# EAGLE schematic hand_rev_1.0 (EAGLE 9.2.2)
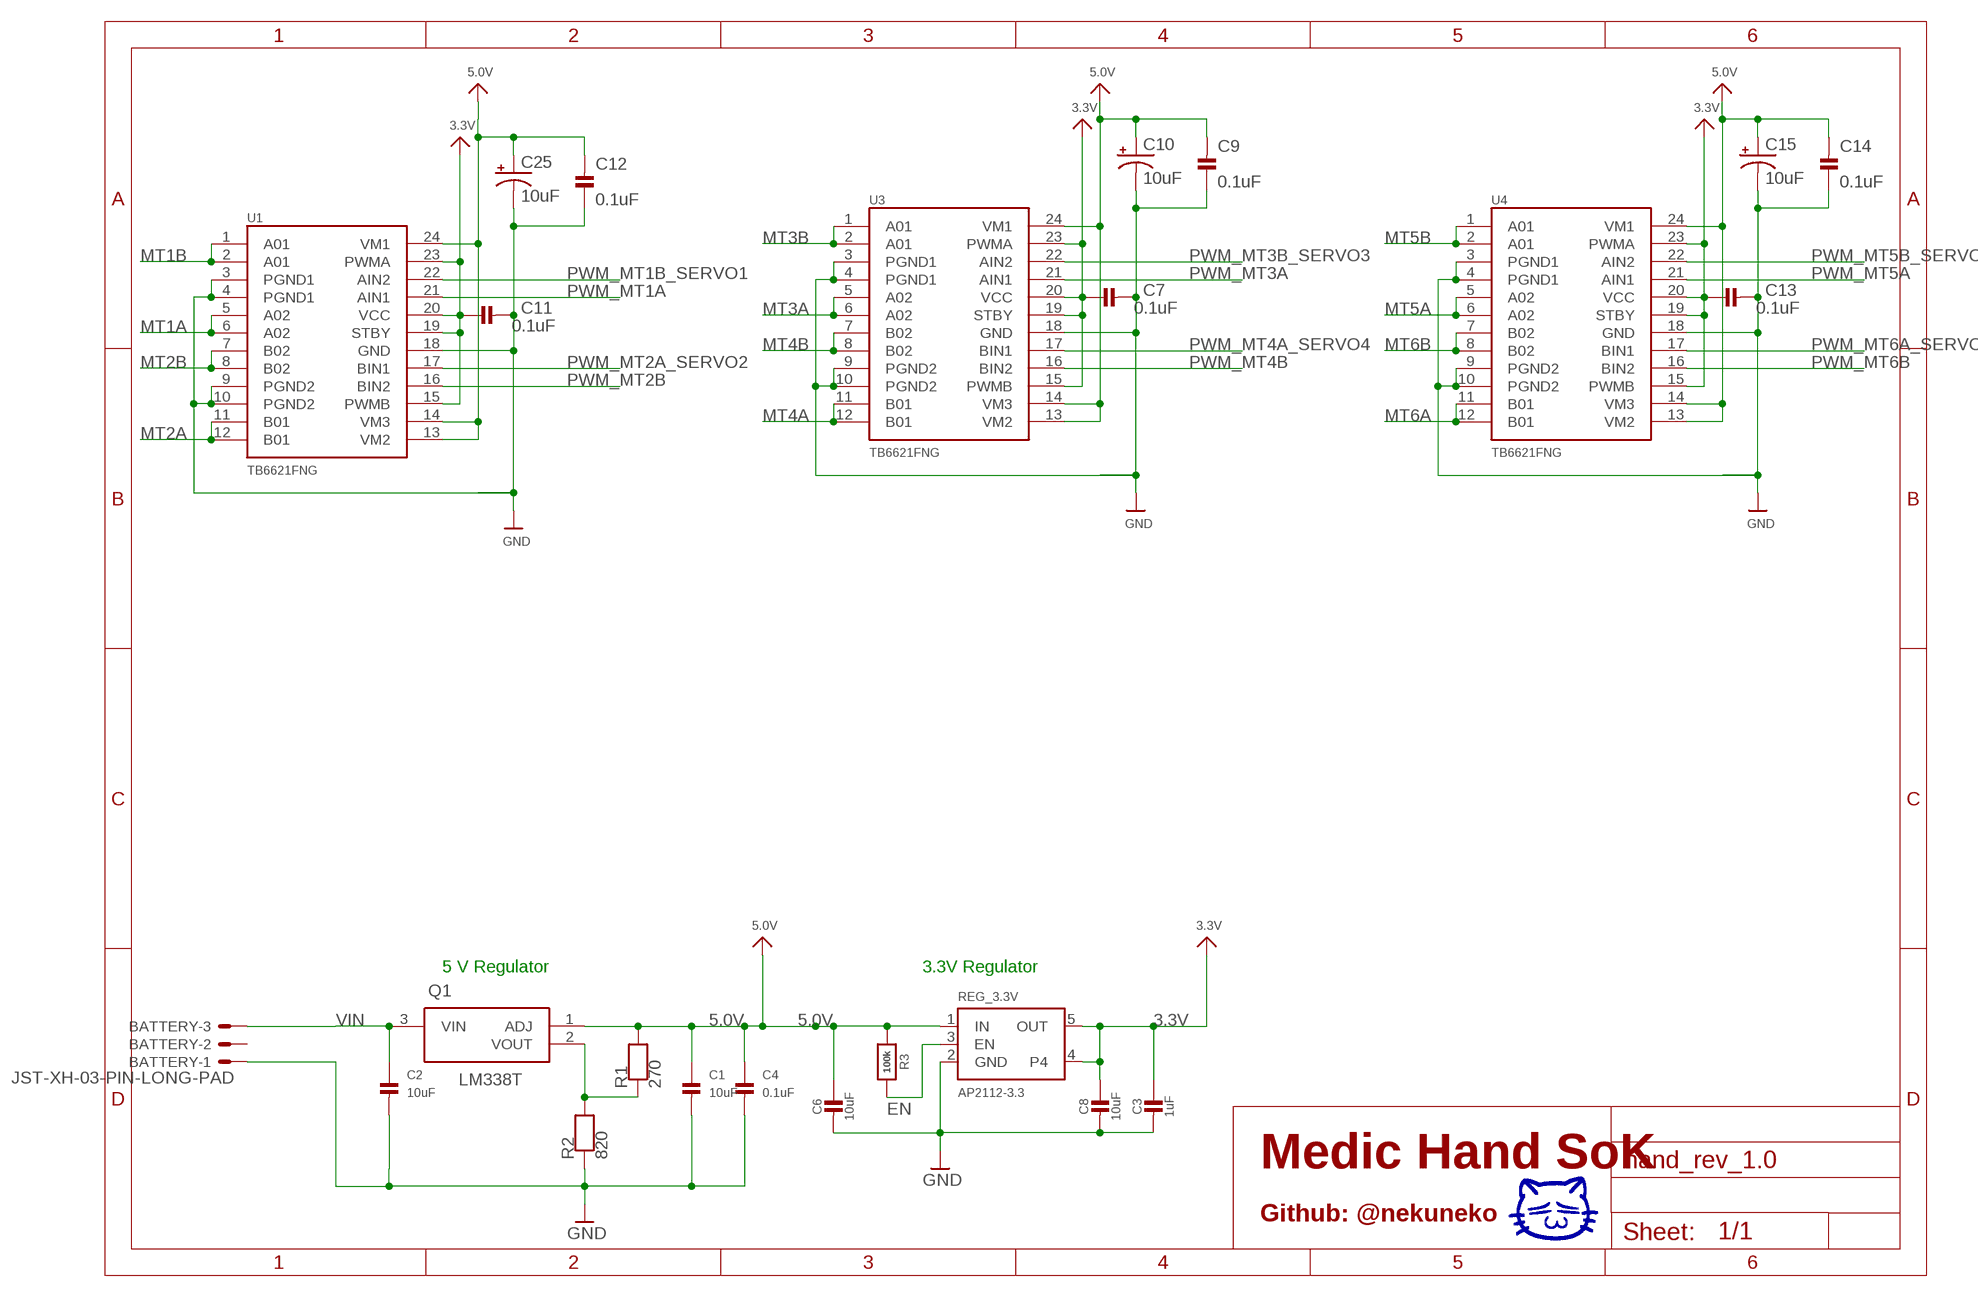
[diagram p0: schematic, sheet 1, part 1 of 2]
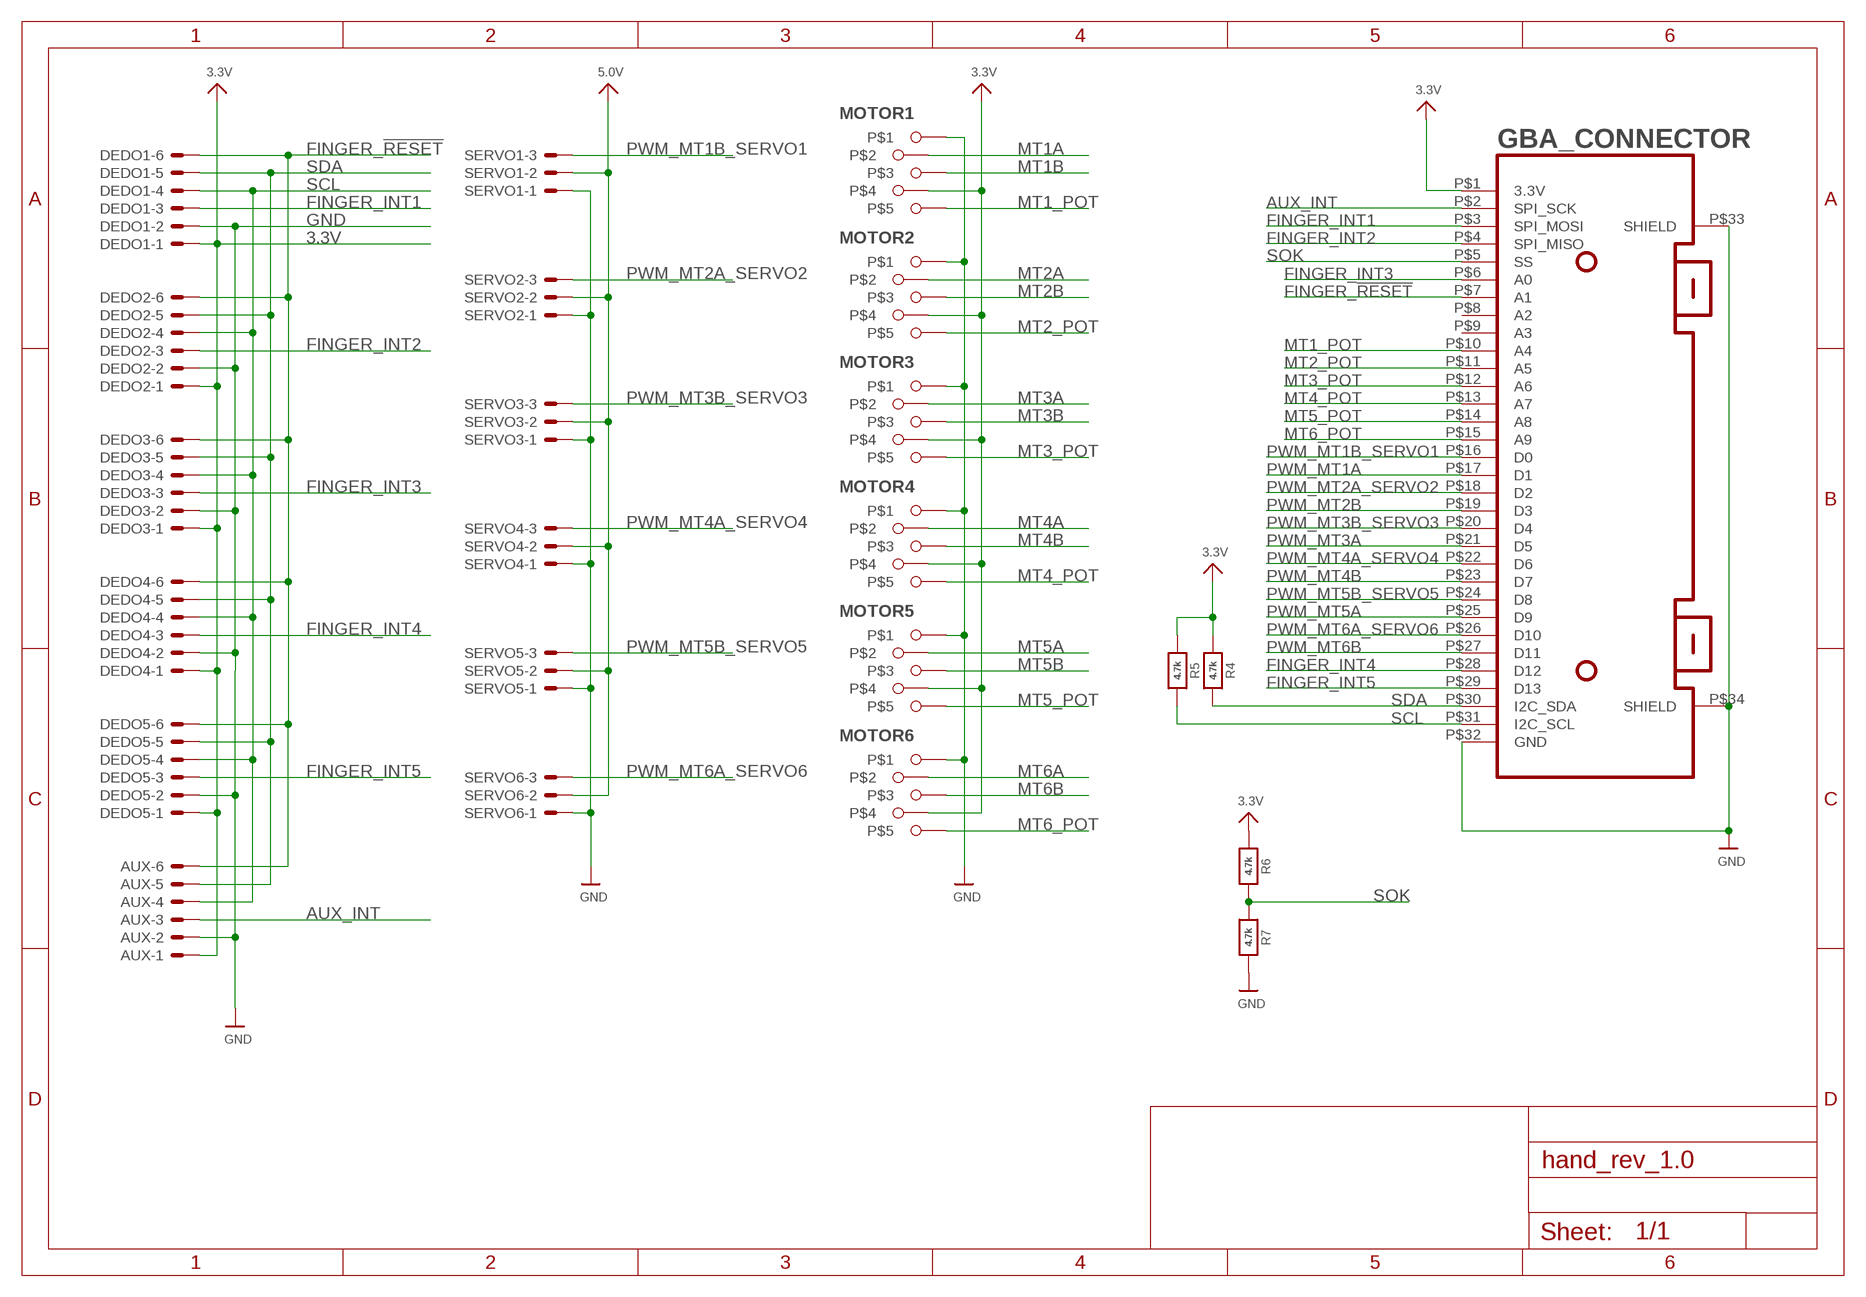
[diagram p1: schematic, sheet 1, part 2 of 2]

## Parts
AUX  FINGER_5  BM06B-SRSS-TB  [BM06B-SRSS-TB]
BATTERY  JST-XH-03-PIN-LONG-PAD  [JST-XH-03-PACKAGE-LONG-PAD]
C1  10uF  CAP_CERAMIC_0805  [_0805]
C2  10uF  CAP_CERAMIC_0805  [_0805]
C3  1uF  CAP_CERAMIC_0603  [_0603]
C4  0.1uF  CAP_CERAMIC_0805  [_0805]
C6  10uF  CAP_CERAMIC_0603  [_0603]
C7  0.1uF  CAP_CERAMIC_0603  [_0603]
C8  10uF  CAP_CERAMIC_0603  [_0603]
C9  0.1uF  CAP_CERAMIC_0603  [_0603]
C10  10uF  10UF-POLAR-0603-6.3V-20%(TANT)  [0603-POLAR]
C11  0.1uF  CAP_CERAMIC_0603  [_0603]
C12  0.1uF  CAP_CERAMIC_0603  [_0603]
C13  0.1uF  CAP_CERAMIC_0603  [_0603]
C14  0.1uF  CAP_CERAMIC_0603  [_0603]
C15  10uF  10UF-POLAR-0603-6.3V-20%(TANT)  [0603-POLAR]
C25  10uF  10UF-POLAR-0603-6.3V-20%(TANT)  [0603-POLAR]
DEDO1  FINGER_1  BM06B-SRSS-TB  [BM06B-SRSS-TB]
DEDO2  FINGER_2  BM06B-SRSS-TB  [BM06B-SRSS-TB]
DEDO3  FINGER_3  BM06B-SRSS-TB  [BM06B-SRSS-TB]
DEDO4  FINGER_4  BM06B-SRSS-TB  [BM06B-SRSS-TB]
DEDO5  FINGER_5  BM06B-SRSS-TB  [BM06B-SRSS-TB]
GBA_CONNECTOR  GBA_CARTRIDGE  [GBA_CARTRIDGE]
MOTOR1  MOTOR1  5PIN  [5PIN]
MOTOR2  MOTOR2  5PIN  [5PIN]
MOTOR3  MOTOR3  5PIN  [5PIN]
MOTOR4  MOTOR4  5PIN  [5PIN]
MOTOR5  MOTOR5  5PIN  [5PIN]
MOTOR6  MOTOR6  5PIN  [5PIN]
Q1  LM338T  [TO220]
R1  270  RESISTOR_0805  [_0805]
R2  820  RESISTOR_0805  [_0805]
R3  100k  RESISTOR_0603  [_0603]
R4  4.7k  RESISTOR_0603  [_0603]
R5  4.7k  RESISTOR_0603  [_0603]
R6  4.7k  RESISTOR_0603  [_0603]
R7  4.7k  RESISTOR_0603  [_0603]
REG_3.3V  AP2112-3.3  VREG_SOT23-5  [SOT23-5]
SERVO1  JST-XH-03-PIN-LONG-PAD  [JST-XH-03-PACKAGE-LONG-PAD]
SERVO2  JST-XH-03-PIN-LONG-PAD  [JST-XH-03-PACKAGE-LONG-PAD]
SERVO3  JST-XH-03-PIN-LONG-PAD  [JST-XH-03-PACKAGE-LONG-PAD]
SERVO4  JST-XH-03-PIN-LONG-PAD  [JST-XH-03-PACKAGE-LONG-PAD]
SERVO5  JST-XH-03-PIN-LONG-PAD  [JST-XH-03-PACKAGE-LONG-PAD]
SERVO6  JST-XH-03-PIN-LONG-PAD  [JST-XH-03-PACKAGE-LONG-PAD]
U1  TB6621FNG  [SSOP24]
U3  TB6621FNG  [SSOP24]
U4  TB6621FNG  [SSOP24]

## Nets
3.3V: AUX.1 C3.1 C7.1 C8.1 C11.1 C13.1 DEDO1.1 DEDO2.1 DEDO3.1 DEDO4.1 DEDO5.1 GBA_CONNECTOR.P$1(3.3V) MOTOR1.4 MOTOR2.4 MOTOR3.4 MOTOR4.4 MOTOR5.4 MOTOR6.4 R4.1 R5.1 R6.1 REG_3.3V.4 REG_3.3V.5(OUT) U1.15(PWMB) U1.19(STBY) U1.20(VCC) U1.23(PWMA) U3.15(PWMB) U3.19(STBY) U3.20(VCC) U3.23(PWMA) U4.15(PWMB) U4.19(STBY) U4.20(VCC) U4.23(PWMA)
5.0V: C1.1 C4.1 C6.1 C9.2 C10.+ C12.2 C14.2 C15.+ C25.+ Q1.1(ADJ) R1.2 R3.1 REG_3.3V.1(IN) SERVO1.2 SERVO2.2 SERVO3.2 SERVO4.2 SERVO5.2 SERVO6.2 U1.13(VM2) U1.14(VM3) U1.24(VM1) U3.13(VM2) U3.14(VM3) U3.24(VM1) U4.13(VM2) U4.14(VM3) U4.24(VM1)
AUX_INT: AUX.3 GBA_CONNECTOR.P$2(SPI_SCK)
EN: R3.2 REG_3.3V.3(EN)
FINGER_!RESET: AUX.6 DEDO1.6 DEDO2.6 DEDO3.6 DEDO4.6 DEDO5.6 GBA_CONNECTOR.P$7(A1)
FINGER_INT1: DEDO1.3 GBA_CONNECTOR.P$3(SPI_MOSI)
FINGER_INT2: DEDO2.3 GBA_CONNECTOR.P$4(SPI_MISO)
FINGER_INT3: DEDO3.3 GBA_CONNECTOR.P$6(A0)
FINGER_INT4: DEDO4.3 GBA_CONNECTOR.P$28(D12)
FINGER_INT5: DEDO5.3 GBA_CONNECTOR.P$29(D13)
GND [gnd]: AUX.2 BATTERY.1 C1.2 C2.2 C3.2 C4.2 C6.2 C7.2 C8.2 C9.1 C10.- C11.2 C12.1 C13.2 C14.1 C15.- C25.- DEDO1.2 DEDO2.2 DEDO3.2 DEDO4.2 DEDO5.2 GBA_CONNECTOR.P$32(GND) GBA_CONNECTOR.P$33(SHIELD) GBA_CONNECTOR.P$34(SHIELD) MOTOR1.1 MOTOR2.1 MOTOR3.1 MOTOR4.1 MOTOR5.1 MOTOR6.1 R2.1 R7.2 REG_3.3V.2(GND) SERVO1.1 SERVO2.1 SERVO3.1 SERVO4.1 SERVO5.1 SERVO6.1 U1.3(PGND1) U1.4(PGND1) U1.9(PGND2) U1.10(PGND2) U1.18(GND) U3.3(PGND1) U3.4(PGND1) U3.9(PGND2) U3.10(PGND2) U3.18(GND) U4.3(PGND1) U4.4(PGND1) U4.9(PGND2) U4.10(PGND2) U4.18(GND)
MT1_POT: GBA_CONNECTOR.P$10(A4) MOTOR1.5
MT1A: MOTOR1.2 U1.5(A02) U1.6(A02)
MT1B: MOTOR1.3 U1.1(A01) U1.2(A01)
MT2_POT: GBA_CONNECTOR.P$11(A5) MOTOR2.5
MT2A: MOTOR2.2 U1.11(B01) U1.12(B01)
MT2B: MOTOR2.3 U1.7(B02) U1.8(B02)
MT3_POT: GBA_CONNECTOR.P$12(A6) MOTOR3.5
MT3A: MOTOR3.2 U3.5(A02) U3.6(A02)
MT3B: MOTOR3.3 U3.1(A01) U3.2(A01)
MT4_POT: GBA_CONNECTOR.P$13(A7) MOTOR4.5
MT4A: MOTOR4.2 U3.11(B01) U3.12(B01)
MT4B: MOTOR4.3 U3.7(B02) U3.8(B02)
MT5_POT: GBA_CONNECTOR.P$14(A8) MOTOR5.5
MT5A: MOTOR5.2 U4.5(A02) U4.6(A02)
MT5B: MOTOR5.3 U4.1(A01) U4.2(A01)
MT6_POT: GBA_CONNECTOR.P$15(A9) MOTOR6.5
MT6A: MOTOR6.2 U4.11(B01) U4.12(B01)
MT6B: MOTOR6.3 U4.7(B02) U4.8(B02)
N$1: Q1.2(VOUT) R1.1 R2.2
PWM_MT1A: GBA_CONNECTOR.P$17(D1) U1.21(AIN1)
PWM_MT1B_SERVO1: GBA_CONNECTOR.P$16(D0) SERVO1.3 U1.22(AIN2)
PWM_MT2A_SERVO2: GBA_CONNECTOR.P$18(D2) SERVO2.3 U1.17(BIN1)
PWM_MT2B: GBA_CONNECTOR.P$19(D3) U1.16(BIN2)
PWM_MT3A: GBA_CONNECTOR.P$21(D5) U3.21(AIN1)
PWM_MT3B_SERVO3: GBA_CONNECTOR.P$20(D4) SERVO3.3 U3.22(AIN2)
PWM_MT4A_SERVO4: GBA_CONNECTOR.P$22(D6) SERVO4.3 U3.17(BIN1)
PWM_MT4B: GBA_CONNECTOR.P$23(D7) U3.16(BIN2)
PWM_MT5A: GBA_CONNECTOR.P$25(D9) U4.21(AIN1)
PWM_MT5B_SERVO5: GBA_CONNECTOR.P$24(D8) SERVO5.3 U4.22(AIN2)
PWM_MT6A_SERVO6: GBA_CONNECTOR.P$26(D10) SERVO6.3 U4.17(BIN1)
PWM_MT6B: GBA_CONNECTOR.P$27(D11) U4.16(BIN2)
SCL: AUX.4 DEDO1.4 DEDO2.4 DEDO3.4 DEDO4.4 DEDO5.4 GBA_CONNECTOR.P$31(I2C_SCL) R5.2
SDA: AUX.5 DEDO1.5 DEDO2.5 DEDO3.5 DEDO4.5 DEDO5.5 GBA_CONNECTOR.P$30(I2C_SDA) R4.2
SOK: GBA_CONNECTOR.P$5(SS) R6.2 R7.1
VIN: BATTERY.3 C2.1 Q1.3(VIN)
Unconnected: BATTERY.2 GBA_CONNECTOR.P$8(A2) GBA_CONNECTOR.P$9(A3)

## Notes on the sheet
- 5 V Regulator | 3.3V Regulator
- Medic Hand SoK
- Github: @nekuneko

## Library data of the parts
AUX DEDO1-DEDO5 = con-jst:?M06B-SRSS-TB: Disconnectable Crimp style connector, 1.0mm pitch 6 contacts
BATTERY SERVO1-SERVO6 = JST XH Connectors v1-0:JST-XH-03-PIN: JST XH Connector 2 Pin Wire to board connector. Pitch: 2,54 mm, (0.100") Number of pins: 3 Created by Rembrandt Electronics www.rembrandtelectronics.com
C1-C4 C6-C9 C11-C14 = microbuilder:CAP_CERAMIC: Ceramic Capacitors 0402 - 0402 Surface Mount Capacitors 16pF 50V 5% [Digikey: 445-4899-2-ND] 18pF 50V 5% [Digikey: 490-1281-2-ND] 22pF 50V 5% [Digikey: 490-1283-2-ND] 68pF 50V 5% [Digikey: 490-1289-2-ND] 0.1uF 10V 10% [Digikey: 490-1318-2-ND] 1.0uF 6.3V 10% [Digikey: 490-1320-2-ND] 0603 - 0603 Surface Mount Capacitors 16 pF 50V 5% [Digikey: 445-5051-2-ND] 22 pF 50V [Digikey: PCC220ACVTR-ND] 33 pF 50V 5% [Digikey: 490-1415-1-ND] 56pF 50V 5% [Digikey: 490-1421-1-ND] 220pF 50V 5% [Digikey: 445-1285-1-ND] 680 pF 50V 2200 pF 50V 5% C0G [Digikey: 445-1297-1-ND] 5600 pF 100V 5% X7R [Digikey: 478-3711-1-ND] 0.1 µF 25V 10% [Digikey: PCC2277TR-ND] 0.22 µF 16V 10% X7R [Digikey: 445-1318-1-ND] 1.0 µF 25V 10% [Digikey: 445-5146-2-ND] 0603 - RF Specific 3pF 250V +/-0.1pF RF [Digikey: 712-1347-1-ND] 18 pF 250V 5% [Digikey: 478-3505-1-ND or 712-1322-1-ND] 56 pF 250V 5% C0G RF [Digikey: 490-4867-1-ND] 68 pF 250V RF [Digikey: 490-4868-1-ND] 0805 - 0805 Surface Mount Capacitors 220 pF 250V 2% RF Ceramic Capacitor [Digikey: 712-1398-1-ND] 1000 pF 50V 2% NP0 Ceramic Capacitor [Digikey: 478-3760-1-ND] 0.1 µF 25V 10% Ceramic Capacitor [Digikey: PCC1828TR-ND] 1.0 µF 16V 10% Ceramic Capacitor[Digikey: 490-1691-2-ND] 10.0 µF 10V 10% Ceramic Capacitor[Digikey: 709-1228-1-ND] 10.0 uF 16V 10% Ceramic Capacitor [Digikey: 478-5165-2-ND] 47 uF 6.3V 20% Ceramic Capacitor [Digikey: 587-1779-1-ND or 399-5506-1-ND] 1206 - 1206 Surface Mount Capacitors 47uF 10V 20% Ceramic Capacitor [Digikey: 490-5528-1-ND or 399-5508-1-ND or 445-6010-1-ND] 100uF 6.3V -20%, +80% Y5V Ceramic Capacitor (Digikey: 490-4512-1-ND, Mouser: 81-GRM31CF50J107ZE1L)
C10 C15 C25 = SparkFun-Capacitors:10UF-POLAR: 10.0µF polarized capacitors A capacitor is a passive two-terminal electrical component used to store electrical energy temporarily in an electric field.; MPN: F981A106MMA; PROD_ID: CAP-13210
GBA_CONNECTOR = 0SoK:GBA_CARTRIDGE: GBA Cartridge Slot for NDS - from Aliexpress Gontak SoK main interface
MOTOR1-MOTOR6 = 0SoK:5PIN
Q1 = 0SoK:LM338T: LM338 5-Amp Adjustable Regulator Datashset: http://www.ti.com/lit/ds/snvs771c/snvs771c.pdf
R1-R7 = microbuilder:RESISTOR: Resistors 0402 - 0402 Surface Mount Package 22 Ohm 1% 1/16W [Digikey: 311-22.0LRTR-ND] 33 Ohm 5% 1/16W 1.0K 5% 1/16W 1.5K 5% 1/16W 2.0K 1% 1/16W 10.0K 1% 1/16W [Digikey: 311-10.0KLRTR-ND] 10.0K 5% 1/16W [Digikey: RMCF0402JT10K0TR-ND] 12.1K 1% 1/16W [Digikey: 311-22.0LRTR-ND] 100.0K 5% 1/16W 0603 - 0603 Surface Mount Package 0 Ohm 1/10 Watt 1% Resistor 15 Ohm 1/10 Watt 1% Resistor 33 Ohm 1/10 Watt 1% Resistor 49.9 Ohm 1/10 Watt 1% Resistor 100 Ohm 1/10 Watt 1% Resistor 150 Ohm 1/10 Watt 1% Resistor 240 Ohm 1/10 Watt 1% Resistor 390 Ohm 1/10 Watt 1% Resistor 560 Ohm 1/10 Watt 1% Resistor 680 Ohm 1/10 Watt 1% Resistor 750 Ohm 1/10 Watt 1% Resistor 1.0K Ohm 1/10 Watt 1% Resistor 1.5K Ohm 1/10 Watt 1% Resistor 2.0K Ohm 1/10 Watt 1% Resistor 2.2K Ohm 1/10 Watt 1% Resistor 3.3K Ohm 1/10 Watt 1% Resistor 4.7K Ohm 1/10 Watt 1% Resistor 10.0K Ohm 1/10 Watt 1% Resistor 12.0K Ohm 1/10 Watt 1% Resistor 12.1K Ohm 1/10 Watt 1% Resistor 20.0K Ohm 1/10 Watt 1% Resistor 33.0K Ohm 1/10 Watt 1% Resistor 100.0K Ohm 1/10 Watt 1% Resistor 0805 - 0805 Surface Mount Package 0 Ohm 1/8 Watt 1% Resistor 33 Ohm 1/8 Watt 1% Resistor 100 Ohm 1/8 Watt 1% Resistor 150 Ohm 1/8 Watt 1% Resistor 200 Ohm 1/8 Watt 1% Resistor 240 Ohm 1/8 Watt 1% Resistor 330 Ohm 1/8 Watt 1% Resistor 390 Ohm 1/8 Watt 1% Resistor 470 Ohm 1/8 Watt 1% Resistor 1.0K Ohm 1/8 Watt 1% Resistor 1.5K Ohm 1/8 Watt 1% Resistor 2.0K Ohm 1/8 Watt 1% Resistor 4.7K Ohm 1/8 Watt 1% Resistor 5.1K Ohm 1/8 Watt 1% Resistor 5.6K Ohm 1/8 Watt 1% Resistor 10.0K Ohm 1/8 Watt 1% Resistor 22.0K Ohm 1/8 Watt 1% Resistor 33.0K Ohm 1/8 Watt 1% Resistor 100K Ohm 1/8 Watt 1% Resistor 1206 - 1206 Surface Mount Package 2012 - 2010 Surface Mount Package 0.11 Ohm 1/2 Watt 1% Resistor - Digikey: RHM.11UCT-ND
REG_3.3V = microbuilder:VREG_SOT23-5: SOT23-5 Fixed Voltage Regulators To better organise some of the SOT23-5 fixed voltage regulators in this library, this new part was created. Part Current Out V Out V In V Dropout Digikey Part No. ADP121 150mA 3.3V 3.4-5.5V 0.09V @ 150mA ADP121-AUJZ33R7CT-ND ADP121 150mA 3.0V 3.1-5.5V 0.09V @ 150mA ADP121-AUJZ30R7CT-ND ADP122 300mA 3.3V 3.4-5.5V 0.085V @ 300mA ADP122AUJZ-3.3-R7CT-ND ADP1712 300mA 3.3V 3.5-5.5V 0.17V @ 300mA ADP1712AUJZ-3.3-R7TR-ND AP7311 (Low Cost) 150mA 3.3V 3.5-6V 0.15V @ 150mA AP7311-33WG-7DICT-ND LD39015M18R 150mA 1.8V 1.9V-5.5V 0.08V @ 100mA 497-6977-1-ND MCP1824T-3302E/OT 300mA 3.3V 3.5V-6V 0.2V @ 300mA MCP1824T-3302E/OTCT-ND MIC5205-2.5YM5 TR 150mA 2.5V 2.7-16V 0.165V @ 150mA 576-1257-2-ND MIC5205-3.0YM5 TR 150mA 3.0V 3.2V-16V 0.165V @ 150mA 576-1258-2-ND MIC5205-3.3YM5 TR 150mA 3.3V 3.5V-16V 0.165V @ 150mA 576-1259-2-ND TPS780330220 150mA 3.3V+2.2V 3.6-5.5V 250mV Max 296-23332-1-ND TDA3663/N1,135 100mA 3.3V 3.5-45V 0.18V @ 50mA 568-5343-1-ND
U1 U3 U4 = SparkFun:TB6621FNG: Toshiba 1A motor driver

## Net classes
2 gnd: width 0.254 mm, drill 0.61 mm, clearance 0.254 mm